# Altium schematic sheet Main.SchDoc
size A3
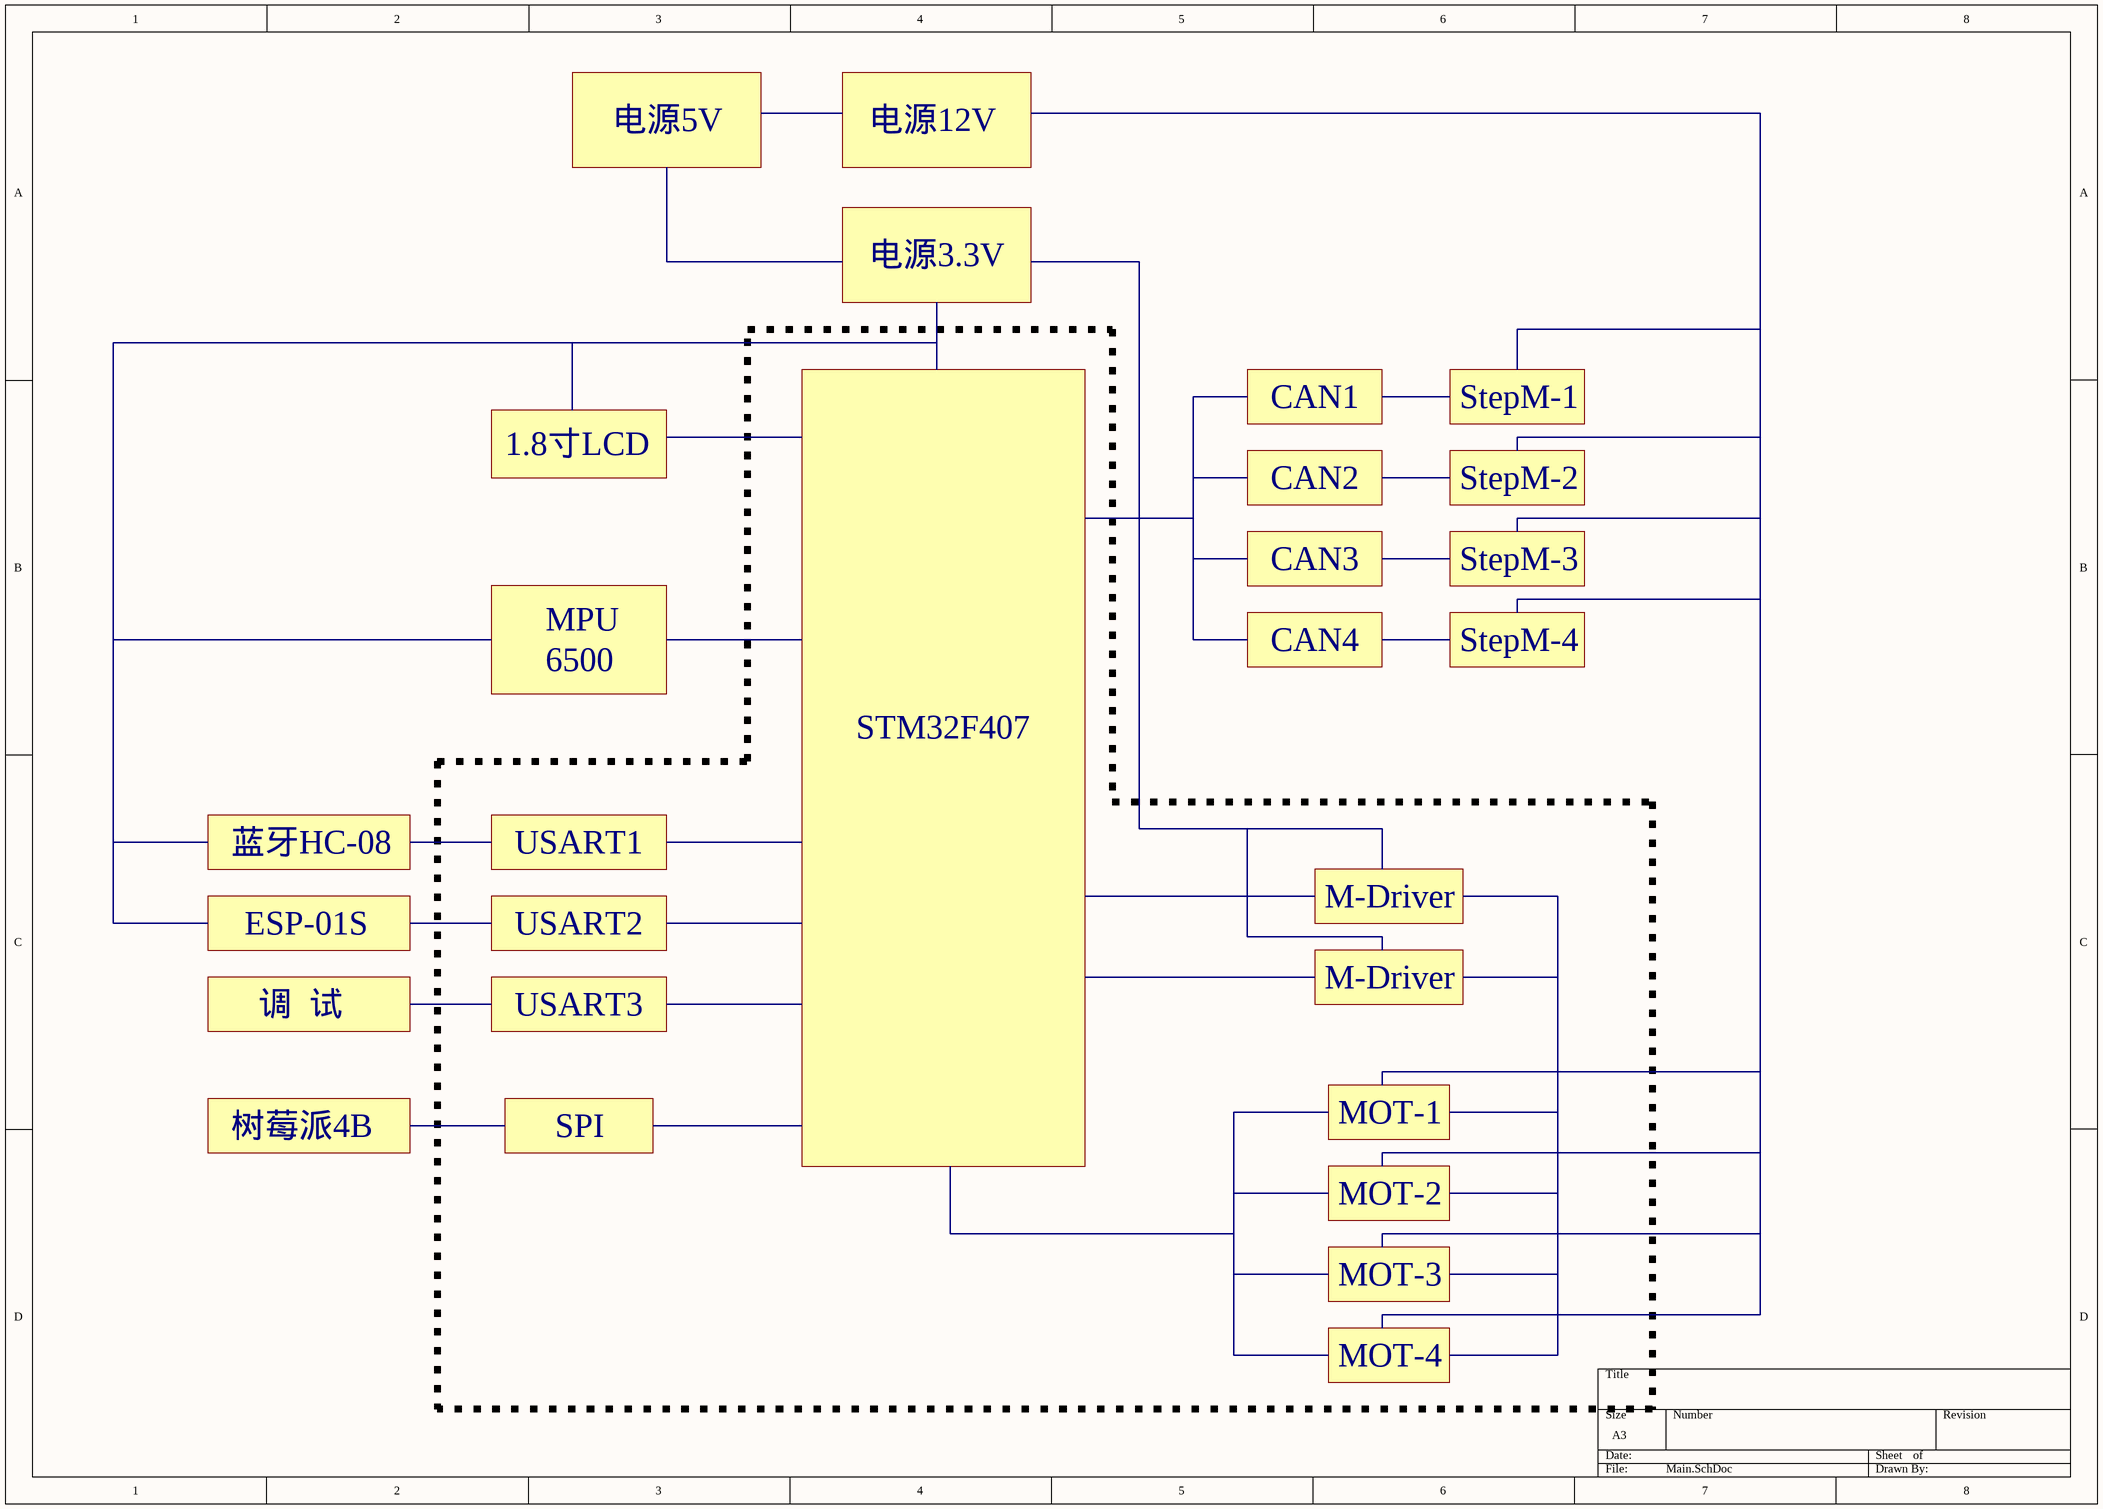
[diagram p0: Main.SchDoc]

## Notes on the sheet
- 电源5V
- 电源12V
- 电源3.3V
- CAN1
- StepM-1
- 1.8寸LCD
- CAN2
- StepM-2
- CAN3
- StepM-3
- MPU
- 6500
- CAN4
- StepM-4
- STM32F407
- 蓝牙HC-08
- USART1
- M-Driver
- ESP-01S
- USART2
- 调  试
- USART3
- MOT-1
- 树莓派4B
- SPI
- MOT-2
- MOT-3
- MOT-4